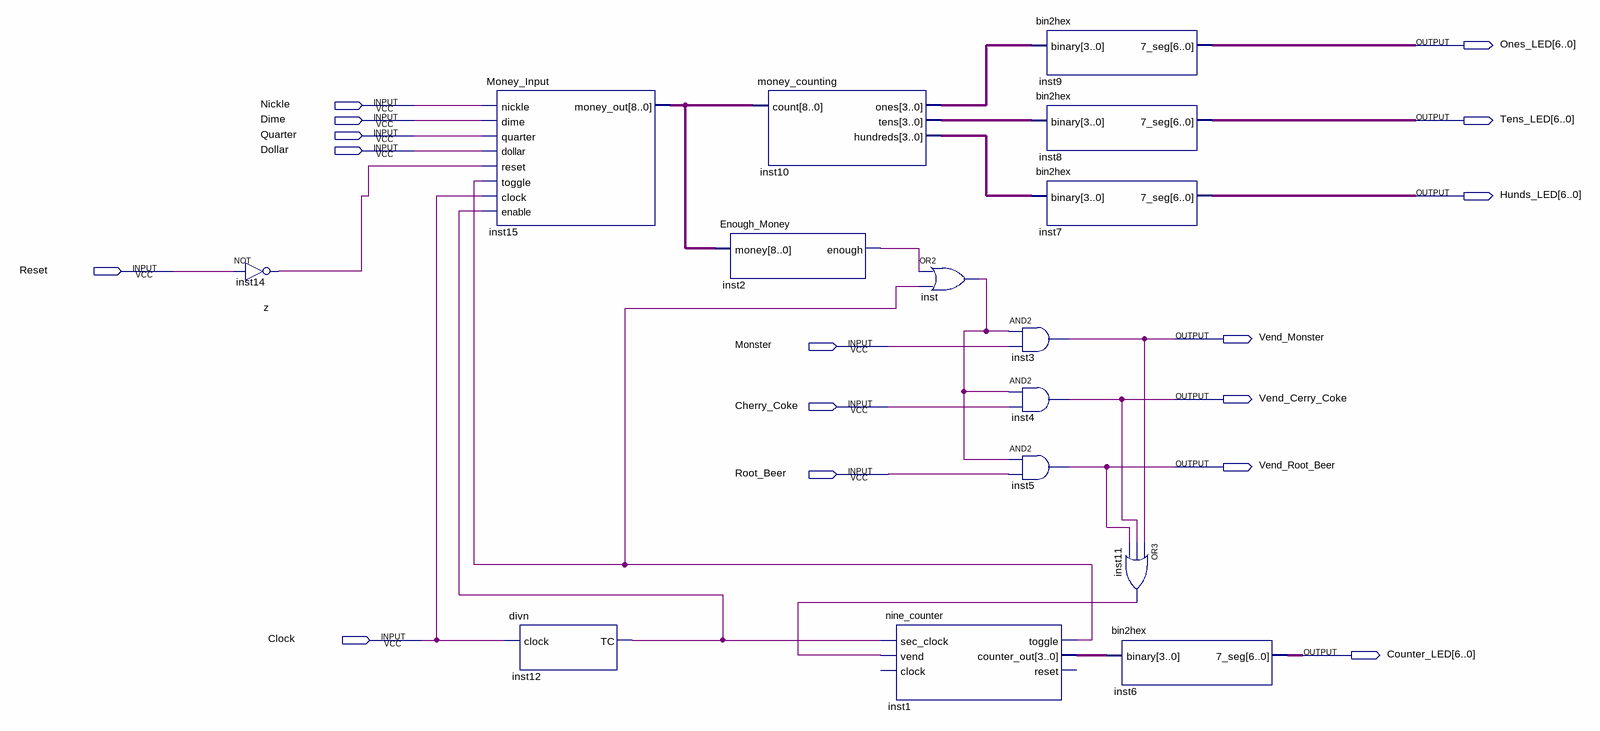
[diagram p0: schematic sheet]
// Quartus schematic Miniproject.bdf as structural Verilog: 15 symbols, 16 pins
module Miniproject (
  input  Nickle,
  input  Dime,
  input  Quarter,
  input  Dollar,
  input  Reset,
  input  Monster,
  input  Cherry_Coke,
  input  Root_Beer,
  input  Clock,
  output [6:0] Ones_LED,
  output [6:0] Tens_LED,
  output [6:0] Hunds_LED,
  output Vend_Monster,
  output Vend_Cerry_Coke,
  output Vend_Root_Beer,
  output [6:0] Counter_LED
);

  wire inst1_toggle, inst2_enough, inst11_out, inst12_tc, inst_out, z;
  wire [3:0] inst1_counter_out, inst10_hundreds, inst10_ones, inst10_tens;
  wire [8:0] inst15_money_out;

  not inst14 (z, Reset);
  Money_Input inst15 (
    .nickle(Nickle), .dime(Dime), .quarter(Quarter), .dollar(Dollar), .reset(z), .toggle(inst1_toggle),
    .clock(Clock), .enable(inst12_tc), .money_out(inst15_money_out));
  divn inst12 (.clock(Clock), .TC(inst12_tc));
  money_counting inst10 (.count(inst15_money_out), .ones(inst10_ones), .tens(inst10_tens), .hundreds(inst10_hundreds));
  Enough_Money inst2 (.money(inst15_money_out), .enough(inst2_enough));
  or inst (inst_out, inst2_enough, inst1_toggle);
  nine_counter inst1 (
    .sec_clock(inst12_tc), .vend(inst11_out), .toggle(inst1_toggle), .counter_out(inst1_counter_out));  // open: clock, reset
  bin2hex inst9 (.binary(inst10_ones), .\7_seg (Ones_LED));
  bin2hex inst8 (.binary(inst10_tens), .\7_seg (Tens_LED));
  bin2hex inst7 (.binary(inst10_hundreds), .\7_seg (Hunds_LED));
  and inst3 (Vend_Monster, inst_out, Monster);
  and inst4 (Vend_Cerry_Coke, inst_out, Cherry_Coke);
  and inst5 (Vend_Root_Beer, inst_out, Root_Beer);
  or inst11 (inst11_out, Vend_Monster, Vend_Cerry_Coke, Vend_Root_Beer);
  bin2hex inst6 (.binary(inst1_counter_out), .\7_seg (Counter_LED));
endmodule
